# EAGLE design osdelux_proto_proc (EAGLE 8.5.1)
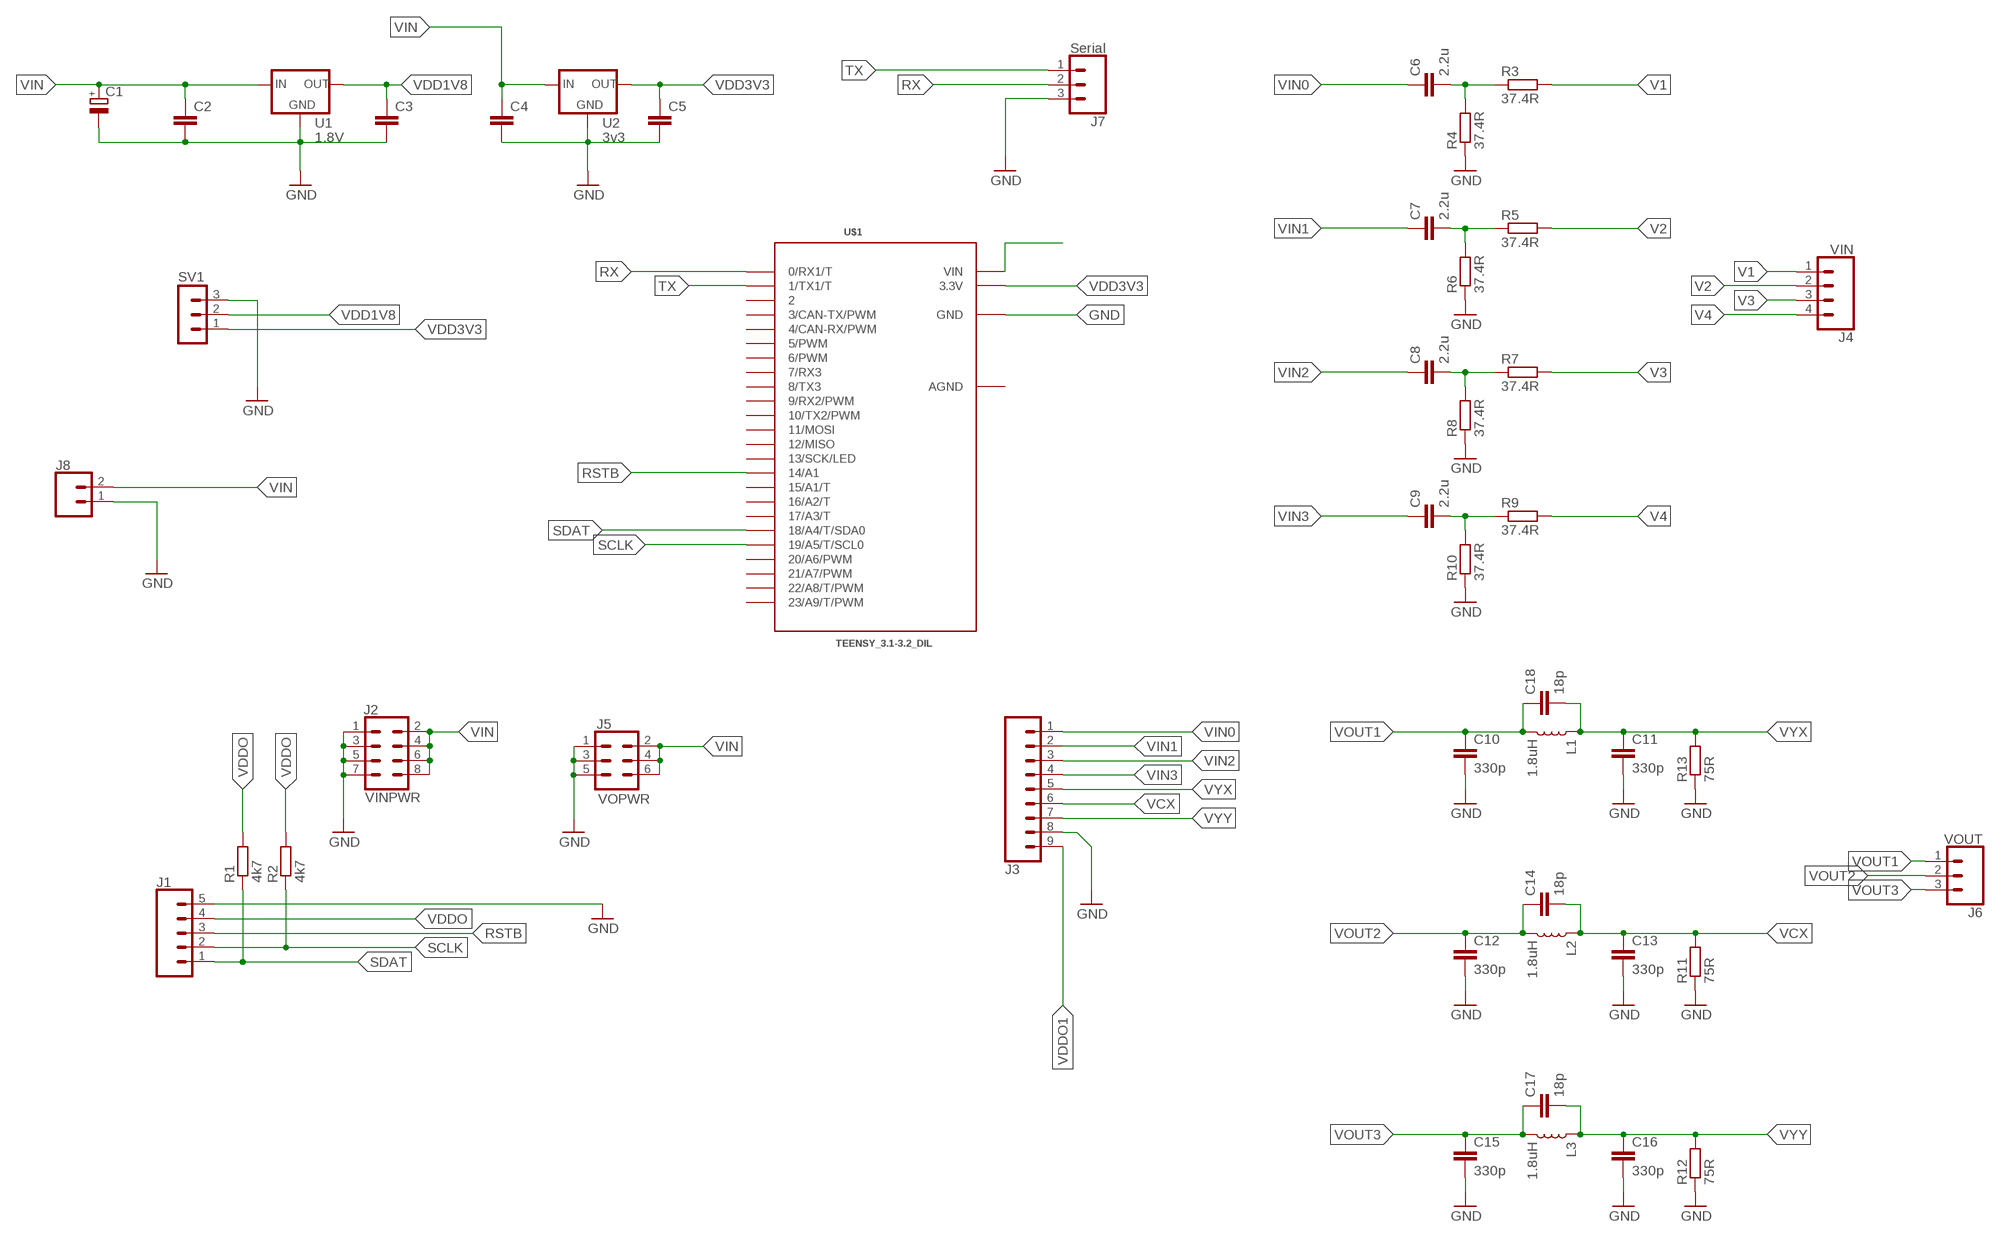
[diagram p0: schematic, sheet 1]

## Parts
C1  CPOL-EUE3.5-8  [E3,5-8]
C2  C-EUC1206K  [C1206K]
C3  C-EUC1206K  [C1206K]
C4  C-EUC1206K  [C1206K]
C5  C-EUC1206K  [C1206K]
C6  2.2u  C-EUC1206  [C1206]
C7  2.2u  C-EUC1206  [C1206]
C8  2.2u  C-EUC1206  [C1206]
C9  2.2u  C-EUC1206  [C1206]
C10  330p  C-EUC0805  [C0805]
C11  330p  C-EUC0805  [C0805]
C12  330p  C-EUC0805  [C0805]
C13  330p  C-EUC0805  [C0805]
C14  18p  C-EUC0805  [C0805]
C15  330p  C-EUC0805  [C0805]
C16  330p  C-EUC0805  [C0805]
C17  18p  C-EUC0805  [C0805]
C18  18p  C-EUC0805  [C0805]
J1  CONN_05LOCK_LONGPADS  [1X05_LOCK_LONGPADS]
J2  VINPWR  CONN_04X2  [2X4]
J3  CONN_09LOCK-LONGPADS  [1X09_LOCK_LONGPADS]
J4  VIN  CONN_04  [1X04]
J5  VOPWR  CONN_03X2FEMALE  [2X3]
J6  VOUT  CONN_03  [1X03]
J7  Serial  CONN_03  [1X03]
J8  CONN_02LOCK_LONGPADS  [1X02_LOCK_LONGPADS]
L1  1.8uH  INDUCTOR-0805-3.3UH  [0805]
L2  1.8uH  INDUCTOR-0805-3.3UH  [0805]
L3  1.8uH  INDUCTOR-0805-3.3UH  [0805]
R1  4k7  R-EU_R0805  [R0805]
R2  4k7  R-EU_R0805  [R0805]
R3  37.4R  R-EU_R0805  [R0805]
R4  37.4R  R-EU_R0805  [R0805]
R5  37.4R  R-EU_R0805  [R0805]
R6  37.4R  R-EU_R0805  [R0805]
R7  37.4R  R-EU_R0805  [R0805]
R8  37.4R  R-EU_R0805  [R0805]
R9  37.4R  R-EU_R0805  [R0805]
R10  37.4R  R-EU_R0805  [R0805]
R11  75R  R-EU_R0805  [R0805]
R12  75R  R-EU_R0805  [R0805]
R13  75R  R-EU_R0805  [R0805]
SV1  MA03-1  [MA03-1]
U1  1.8V  R-78E5.0-1.0  [DC-DC_CONVERTER_78XX]
U2  3v3  R-78E5.0-1.0  [DC-DC_CONVERTER_78XX]
U$1  TEENSY_3.1-3.2_DIL  [TEENSY_3.0-3.2&LC_DIL]

## Nets
DCIN: U$1.VIN
GND: C1.- C2.2 C3.2 C4.2 C5.2 C10.2 C11.2 C12.2 C13.2 C15.2 C16.2 J1.5 J2.1 J2.3 J2.5 J2.7 J3.8 J5.1 J5.3 J5.5 J7.3 J8.1 R4.1 R6.1 R8.1 R10.1 R11.1 R12.1 R13.1 SV1.3 U1.GND U2.GND U$1.GND
N$1: C6.2 R3.1 R4.2
N$3: C7.2 R5.1 R6.2
N$4: C8.2 R7.1 R8.2
N$5: C9.2 R9.1 R10.2
RSTB: J1.3 U$1.14/A0(14/A1)
RX: J7.2 U$1.0(0/RX1/T)
SCLK: J1.2 R2.1 U$1.19/A5(19/A5/T/SCL0)
SDAT: J1.1 R1.1 U$1.18/A4(18/A4/T/SDA0)
TX: J7.1 U$1.1(1/TX1/T)
V1: J4.1 R3.2
V2: J4.2 R5.2
V3: J4.3 R7.2
V4: J4.4 R9.2
VCX: C13.1 C14.2 J3.6 L2.1 R11.2
VDD1V8: C3.1 SV1.2 U1.VOUT(OUT)
VDD3V3: C5.1 SV1.1 U2.VOUT(OUT) U$1.3.3V
VDDO: J1.4 R1.2 R2.2
VDDO1: J3.9
VIN: C1.+ C2.1 C4.1 J2.2 J2.4 J2.6 J2.8 J5.2 J5.4 J5.6 J8.2 U1.VIN(IN) U2.VIN(IN)
VIN0: C6.1 J3.1
VIN1: C7.1 J3.2
VIN2: C8.1 J3.3
VIN3: C9.1 J3.4
VOUT1: C10.1 C18.1 J6.1 L1.2
VOUT2: C12.1 C14.1 J6.2 L2.2
VOUT3: C15.1 C17.1 J6.3 L3.2
VYX: C11.1 C18.2 J3.5 L1.1 R13.2
VYY: C16.1 C17.2 J3.7 L3.1 R12.2
Unconnected: U$1.2 U$1.3(3/CAN-TX/PWM) U$1.4(4/CAN-RX/PWM) U$1.5(5/PWM) U$1.6(6/PWM) U$1.7(7/RX3) U$1.8(8/TX3) U$1.9(9/RX2/PWM) U$1.10(10/TX2/PWM) U$1.11(11/MOSI) U$1.12(12/MISO) U$1.13(13/SCK/LED) U$1.15/A1(15/A1/T) U$1.16/A2(16/A2/T) U$1.17/A3(17/A3/T) U$1.20/A6(20/A6/PWM) U$1.21/A7(21/A7/PWM) U$1.22/A8(22/A8/T/PWM) U$1.23/A9(23/A9/T/PWM)

## Power pins joined to a net without a drawn wire
AGND: U$1.AGND

## Library data of the parts
C1 = rcl:CPOL-EU: POLARIZED CAPACITOR, European symbol; SPICEPREFIX: C
C2-C18 = rcl:C-EU: CAPACITOR, European symbol; SPICEPREFIX: C
J1 = SparkFun-Connectors:CONN_05: Multi connection point. Often used as Generic Header-pin footprint for 0.1 inch spaced/style header connections On any of the 0.1 inch spaced packages, you can populate with these: Break Away Headers - Straight <https://www.sparkfun.com/products/116> (PRT-00116) Break Away Male Headers - Right Angle <https://www.sparkfun.com/products/553> (PRT-00553) Female Headers <https://www.sparkfun.com/products/115> (PRT-00115) Break Away Headers - Machine Pin <https://www.sparkfun.com/products/117> (PRT-00117) Break Away Female Headers - Swiss Machine Pin <https://www.sparkfun.com/products/743> (PRT-00743) For SCREWTERMINALS and SPRING TERMINALS visit here: Screw Terimnals on SparkFun.com <https://www.sparkfun.com/search/results?term=Screw+Terminals> (5mm/3.5mm/2.54mm spacing) This device is also useful as a general connection point to wire up your design to another part of your project. Our various solder wires solder well into these plated through hole pads. Hook-Up Wire - Assortment (Stranded, 22 AWG) <https://www.sparkfun.com/products/11375> (PRT-11375) Hook-Up Wire - Assortment (Solid Core, 22 AWG) <https://www.sparkfun.com/products/11367> (PRT-11367) View the entire wire category on our website here <https://www.sparkfun.com/categories/141> Special notes: Molex polarized connector foot print use with SKU : PRT-08231 with associated crimp pins and housings. 1MM SMD Version SKU: PRT-10208
J2 = SparkFun-Connectors:CONN_04X2: Multi connection point. Often used as Generic Header-pin footprint for 0.1 inch spaced/style header connections On any of the 0.1 inch spaced packages, you can populate with these: Break Away Headers - Straight <https://www.sparkfun.com/products/116> (PRT-00116) Break Away Male Headers - Right Angle <https://www.sparkfun.com/products/553> (PRT-00553) Female Headers <https://www.sparkfun.com/products/115> (PRT-00115) Break Away Headers - Machine Pin <https://www.sparkfun.com/products/117> (PRT-00117) Break Away Female Headers - Swiss Machine Pin <https://www.sparkfun.com/products/743> (PRT-00743)
J3 = SparkFun-Connectors:CONN_09: Multi connection point. Often used as Generic Header-pin footprint for 0.1 inch spaced/style header connections On any of the 0.1 inch spaced packages, you can populate with these: Break Away Headers - Straight <https://www.sparkfun.com/products/116> (PRT-00116) Break Away Male Headers - Right Angle <https://www.sparkfun.com/products/553> (PRT-00553) Female Headers <https://www.sparkfun.com/products/115> (PRT-00115) Break Away Headers - Machine Pin <https://www.sparkfun.com/products/117> (PRT-00117) Break Away Female Headers - Swiss Machine Pin <https://www.sparkfun.com/products/743> (PRT-00743) For SCREWTERMINALS and SPRING TERMINALS visit here: Screw Terimnals on SparkFun.com <https://www.sparkfun.com/search/results?term=Screw+Terminals> (5mm/3.5mm/2.54mm spacing) This device is also useful as a general connection point to wire up your design to another part of your project. Our various solder wires solder well into these plated through hole pads. Hook-Up Wire - Assortment (Stranded, 22 AWG) <https://www.sparkfun.com/products/11375> (PRT-11375) Hook-Up Wire - Assortment (Solid Core, 22 AWG) <https://www.sparkfun.com/products/11367> (PRT-11367) View the entire wire category on our website here <https://www.sparkfun.com/categories/141> Special notes: Molex polarized connector foot print use with SKU : PRT-08231 with associated crimp pins and housings. 1MM SMD Version SKU: PRT-10208 NOTES ON THE VARIANTS LOCK and LOCK_LONGPADS... This footprint was designed to help hold the alignment of a through-hole component (i.e. 6-pin header) while soldering it into place. You may notice that each hole has been shifted either up or down by 0.005 of an inch from it's more standard position (which is a perfectly straight line). This slight alteration caused the pins (the squares in the middle) to touch the edges of the holes. Because they are alternating, it causes a "brace" to hold the component in place. 0.005 has proven to be the perfect amount of "off-center" position when using our standard breakaway headers. Although looks a little odd when you look at the bare footprint, once you have a header in there, the alteration is very hard to notice. Also,if you push a header all the way into place, it is covered up entirely on the bottom side.
J4 = SparkFun-Connectors:CONN_04: Multi connection point. Often used as Generic Header-pin footprint for 0.1 inch spaced/style header connections On any of the 0.1 inch spaced packages, you can populate with these: Break Away Headers - Straight <https://www.sparkfun.com/products/116> (PRT-00116) Break Away Male Headers - Right Angle <https://www.sparkfun.com/products/553> (PRT-00553) Female Headers <https://www.sparkfun.com/products/115> (PRT-00115) Break Away Headers - Machine Pin <https://www.sparkfun.com/products/117> (PRT-00117) Break Away Female Headers - Swiss Machine Pin <https://www.sparkfun.com/products/743> (PRT-00743) For SCREWTERMINALS and SPRING TERMINALS visit here: Screw Terimnals on SparkFun.com <https://www.sparkfun.com/search/results?term=Screw+Terminals> (5mm/3.5mm/2.54mm spacing) This device is also useful as a general connection point to wire up your design to another part of your project. Our various solder wires solder well into these plated through hole pads. Hook-Up Wire - Assortment (Stranded, 22 AWG) <https://www.sparkfun.com/products/11375> (PRT-11375) Hook-Up Wire - Assortment (Solid Core, 22 AWG) <https://www.sparkfun.com/products/11367> (PRT-11367) View the entire wire category on our website here <https://www.sparkfun.com/categories/141> Special notes: Molex polarized connector foot print use with SKU : PRT-08231 with associated crimp pins and housings. 1MM SMD Version SKU: PRT-10208; PROD_ID: CONN-09696
J5 = SparkFun-Connectors:CONN_03X2: Multi connection point. Often used as Generic Header-pin footprint for 0.1 inch spaced/style header connections You can populate with any combo of single row headers, but if you'd like an exact match, check these: Header - 2x3 (Male, 0.1") <https://www.sparkfun.com/products/12807> (PRT-12807) Header - 2x3 (Female, 0.1") <https://www.sparkfun.com/products/13010> (PRT-13010) 2x3 Pin Shrouded Header <https://www.sparkfun.com/products/10877> (PRT-10877) On any of the 0.1 inch spaced packages, you can populate with these: Break Away Headers - Straight <https://www.sparkfun.com/products/116> (PRT-00116) Break Away Male Headers - Right Angle <https://www.sparkfun.com/products/553> (PRT-00553) Female Headers <https://www.sparkfun.com/products/115> (PRT-00115) Break Away Headers - Machine Pin <https://www.sparkfun.com/products/117> (PRT-00117) Break Away Female Headers - Swiss Machine Pin <https://www.sparkfun.com/products/743> (PRT-00743) Special note: the shrouded connector mates well with our 3x2 ribbon cables: Ribbon Crimp Connector - 6-pin (2x3, Female) <https://www.sparkfun.com/products/10651> (PRT-10651) Ribbon Cable - 6 wire (15ft) <https://www.sparkfun.com/products/10646> (PRT-10646); PROD_ID: CONN-11566; VALUE: FEMALE 2x3
J6 J7 = SparkFun-Connectors:CONN_03: Multi connection point. Often used as Generic Header-pin footprint for 0.1 inch spaced/style header connections On any of the 0.1 inch spaced packages, you can populate with these: Break Away Headers - Straight <https://www.sparkfun.com/products/116> (PRT-00116) Break Away Male Headers - Right Angle <https://www.sparkfun.com/products/553> (PRT-00553) Female Headers <https://www.sparkfun.com/products/115> (PRT-00115) Break Away Headers - Machine Pin <https://www.sparkfun.com/products/117> (PRT-00117) Break Away Female Headers - Swiss Machine Pin <https://www.sparkfun.com/products/743> (PRT-00743) Stackable Header - 3 Pin (Female, 0.1") <https://www.sparkfun.com/products/13875> (PRT-13875) For SCREWTERMINALS and SPRING TERMINALS visit here: Screw Terimnals on SparkFun.com <https://www.sparkfun.com/search/results?term=Screw+Terminals> (5mm/3.5mm/2.54mm spacing) This device is also useful as a general connection point to wire up your design to another part of your project. Our various solder wires solder well into these plated through hole pads. Hook-Up Wire - Assortment (Stranded, 22 AWG) <https://www.sparkfun.com/products/11375> (PRT-11375) Hook-Up Wire - Assortment (Solid Core, 22 AWG) <https://www.sparkfun.com/products/11367> (PRT-11367) View the entire wire category on our website here <https://www.sparkfun.com/categories/141> Special notes: Molex polarized connector foot print use with SKU : PRT-08232 with associated crimp pins and housings.; PROD_ID: XXX-00000; VALUE: 455-1750-1-ND
J8 = SparkFun-Connectors:CONN_02: Multi connection point. Often used as Generic Header-pin footprint for 0.1 inch spaced/style header connections On any of the 0.1 inch spaced packages, you can populate with these: Break Away Headers - Straight <https://www.sparkfun.com/products/116> (PRT-00116) Break Away Male Headers - Right Angle <https://www.sparkfun.com/products/553> (PRT-00553) Female Headers <https://www.sparkfun.com/products/115> (PRT-00115) Break Away Headers - Machine Pin <https://www.sparkfun.com/products/117> (PRT-00117) Break Away Female Headers - Swiss Machine Pin <https://www.sparkfun.com/products/743> (PRT-00743) For SCREWTERMINALS and SPRING TERMINALS visit here: Screw Terimnals on SparkFun.com <https://www.sparkfun.com/search/results?term=Screw+Terminals> (5mm/3.5mm/2.54mm spacing) This device is also useful as a general connection point to wire up your design to another part of your project. Our various solder wires solder well into these plated through hole pads. Hook-Up Wire - Assortment (Stranded, 22 AWG) <https://www.sparkfun.com/products/11375> (PRT-11375) Hook-Up Wire - Assortment (Solid Core, 22 AWG) <https://www.sparkfun.com/products/11367> (PRT-11367) View the entire wire category on our website here <https://www.sparkfun.com/categories/141> Special notes: Molex polarized connector foot print use with: PRT-08233 with associated crimp pins and housings. 2.54_SCREWTERM for use with PRT-10571. 3.5mm Screw Terminal footprints for PRT-08084 5mm Screw Terminal footprints for use with PRT-08432
L1-L3 = SparkFun-Coils:INDUCTOR: Inductors Resist changes in electrical current. Basically a coil of wire. SparkFun Products: SparkFun Load Cell Amplifier - HX711 <https://www.sparkfun.com/products/13879> IOIO-OTG - V2.2 <https://www.sparkfun.com/products/13613>; PROD_ID: NDUC-13076; VALUE: 3.3µH/±20%/450mA
R1-R13 = rcl:R-EU_: RESISTOR, European symbol; SPICEPREFIX: R
SV1 = con-lstb:MA03-1: PIN HEADER; OC_FARNELL: unknown; OC_NEWARK: unknown
U1 U2 = SparkFun-IC-Power:R-78E5.0-1.0: Recom Power 5V 1A DC/DC Converter The Recom R-78E5.0-X.X is a compact DC/DC converter module that is a pin for pin drop-in replacement for the LM7805 linear voltage regulator. Specifications: Input Range: 7-28V Output Voltage: 5V Output Current: 1A Max Efficiency: 91% Datasheet <https://www.recom-power.com/pdf/Innoline/R-78Exx-1.0.pdf>; PROD_ID: COM-13655
U$1 = Teensy_3_and_LC_Series_Boards_v1.4:TEENSY_3.1-3.2_DIL: Teensy 3.1 or 3.2 in a DIL Layout.

## Board
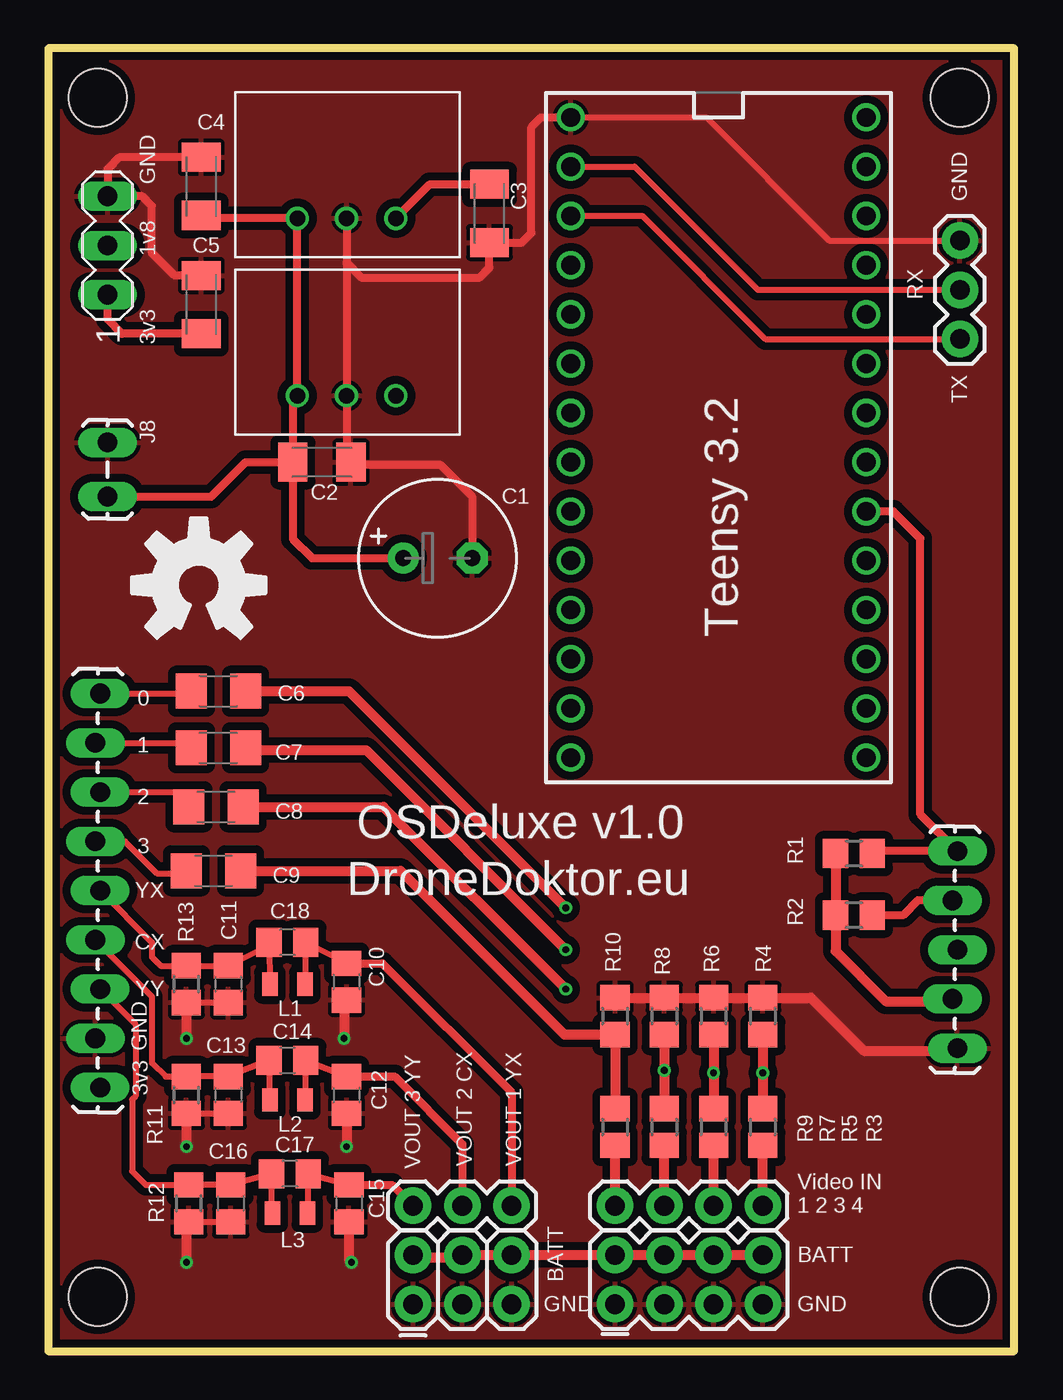
[diagram p1: board, top side]
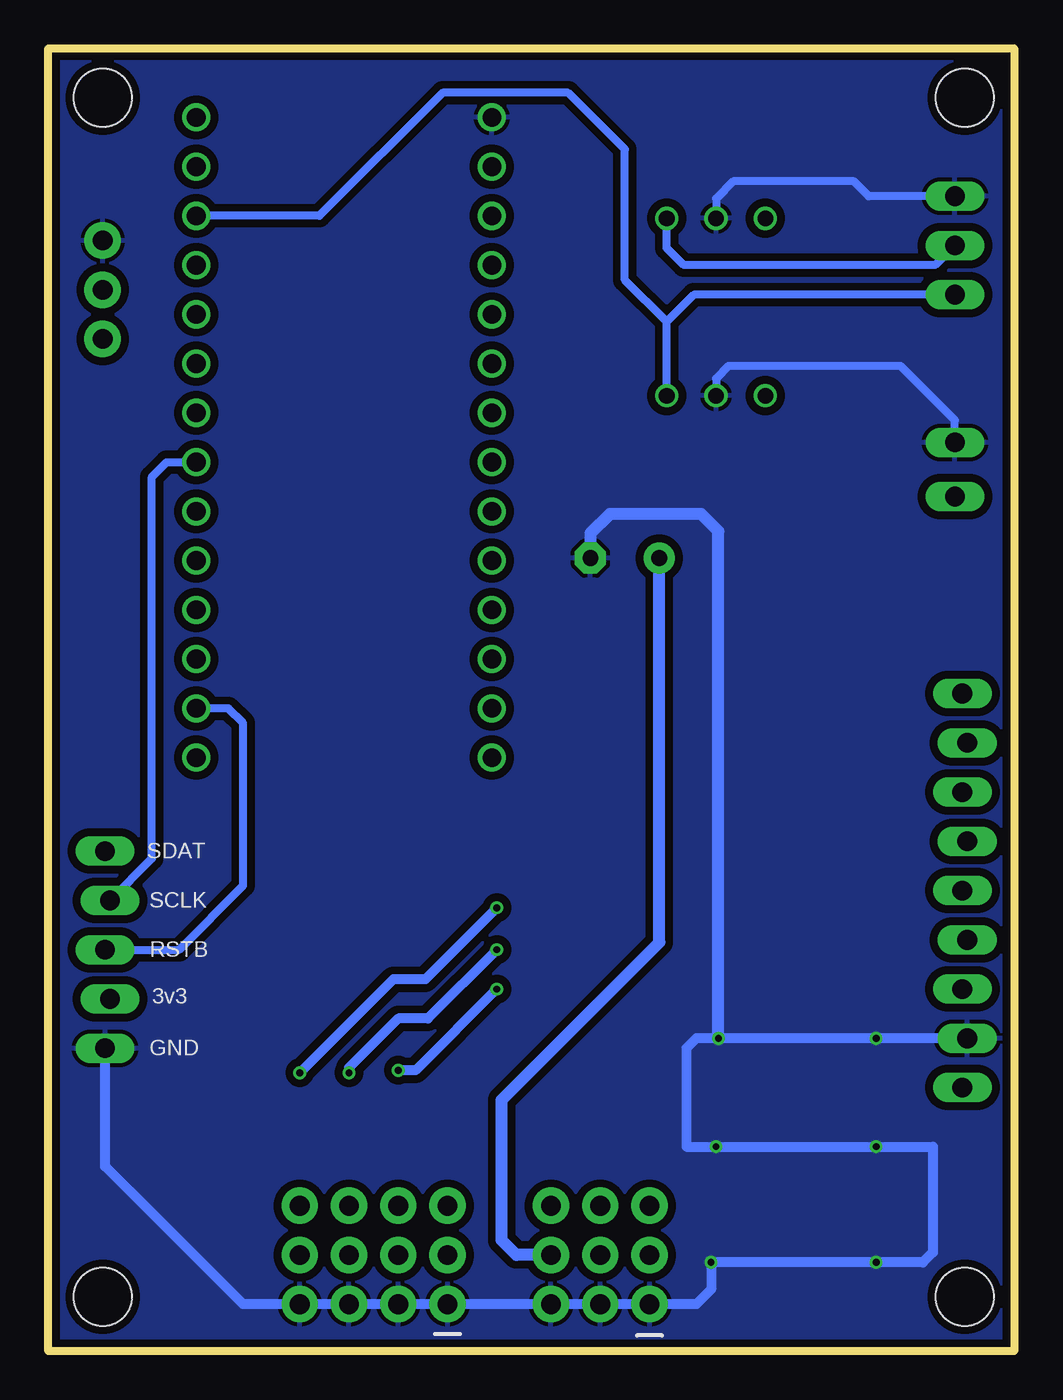
[diagram p2: board, bottom side, seen from below]

Size 49.78 x 67.18 mm. Coordinates in mm from the lower left corner, seen from the top.
Outline: 0,0 49.78,0 49.78,67.18 0,67.18 0,0
Copper layers (1*16): Top 0.018mm / dielectric 1.55mm / Bottom 0.018mm
Design rules "default *": minimum track width 6mil, minimum drill 0.3mm, track to track 6mil, track to pad 6mil, pad to pad 6mil, via to via 6mil, smd to smd 0mil, copper to edge 0.25mm, drill to drill 0.35mm, minimum pad ring 6mil, minimum via ring 6mil, stop-mask expansion 0mil, vias tented up to drill 0.45mm, thermal gap 0.2mm
Holes 3 mm at 46.99,2.79 46.99,64.64 2.54,64.64 2.54,2.79

### Footprints (pad centres in the part's own frame; a part is rotated, then mirrored left to right if it is on the bottom)
E3,5-8 = drill 0.813 pad 1.6: + -1.778,0 | drill 0.813 pad 1.6 octagon: - 1.778,0
C1206K = smd 1.5 x 2: 1 -1.5,0; 2 1.5,0
C1206 = smd 1.6 x 1.8: 1 -1.4,0; 2 1.4,0
C0805 = smd 1.3 x 1.5: 1 -0.95,0; 2 0.95,0
1X05_LOCK_LONGPADS = drill 1.016 long: 1 0,0; 2 2.54,-0.254; 3 5.08,0; 4 7.62,-0.254; 5 10.16,0
2X4 = drill 1.016 pad 1.88: 1 -3.81,-1.27; 2 -3.81,1.27; 3 -1.27,-1.27; 4 -1.27,1.27; 5 1.27,-1.27; 6 1.27,1.27; 7 3.81,-1.27; 8 3.81,1.27
1X09_LOCK_LONGPADS = drill 1.016 long: 1 0,0.127; 2 2.54,-0.127; 3 5.08,0.127; 4 7.62,-0.127; 5 10.16,0.127; 6 12.7,-0.127; 7 15.24,0.127; 8 17.78,-0.127; 9 20.32,0.127
1X04 = drill 1.016 pad 1.88: 1 0,0; 2 2.54,0; 3 5.08,0; 4 7.62,0
2X3 = drill 1.016 pad 1.88: 1 0,0; 2 0,2.54; 3 2.54,0; 4 2.54,2.54; 5 5.08,0; 6 5.08,2.54
1X03 = drill 1.016 pad 1.88: 1 0,0; 2 2.54,0; 3 5.08,0
1X02_LOCK_LONGPADS = drill 1.016 long: 1 -0.127,0; 2 2.667,0
0805 = smd 0.8 x 1.2: 1 -0.9,0; 2 0.9,0
R0805 = smd 1.3 x 1.5: 1 -0.95,0; 2 0.95,0
MA03-1 = drill 1.016 long: 1 -2.54,0; 2 0,0; 3 2.54,0
DC-DC_CONVERTER_78XX = drill 0.8: GND 0,0; VIN -2.54,0; VOUT 2.54,0
TEENSY_3.0-3.2&LC_DIL = drill 0.965: 0 -7.62,13.97; 1 -7.62,11.43; 2 -7.62,8.89; 3 -7.62,6.35; 3.3V 7.62,11.43; 4 -7.62,3.81; 5 -7.62,1.27; 6 -7.62,-1.27; 7 -7.62,-3.81; 8 -7.62,-6.35; 9 -7.62,-8.89; 10 -7.62,-11.43; 11 -7.62,-13.97; 12 -7.62,-16.51; 13 7.62,-16.51; 14/A0 7.62,-13.97; 15/A1 7.62,-11.43; 16/A2 7.62,-8.89; 17/A3 7.62,-6.35; 18/A4 7.62,-3.81; 19/A5 7.62,-1.27; 20/A6 7.62,1.27; 21/A7 7.62,3.81; 22/A8 7.62,6.35; 23/A9 7.62,8.89; AGND 7.62,13.97; GND -7.62,16.51; VIN 7.62,16.51

### Placement (x,y rotation side)
C1  20.07,40.89 0 top
C2  14.1,45.85 0 top
C3  22.73,58.67 270 top
C4  7.87,60.07 90 top
C5  7.87,53.97 90 top
C6  8.76,34.04 0 top
C7  8.76,31.11 0 top
C8  8.64,28.07 0 top
C9  8.51,24.77 0 top
C10  15.37,19.05 270 top
C11  9.27,18.92 270 top
C12  15.37,13.21 270 top
C13  9.27,13.21 270 top
C14  12.32,14.99 180 top
C15  15.49,7.62 270 top
C16  9.4,7.62 270 top
C17  12.45,9.14 180 top
C18  12.32,21.08 180 top
J1  46.86,25.78 270 top
J2  33.02,3.68 0 top
J3  2.54,33.91 270 top
J4  36.83,7.49 180 top
J5  18.8,2.41 0 top
J6  23.88,7.49 180 top
J7  46.99,52.2 90 top
J8  3.05,46.74 270 top
L1  12.32,18.92 0 top
L2  12.32,12.95 0 top
L3  12.45,7.11 0 top
R1  41.53,25.65 180 top
R2  41.53,22.48 180 top
R3  36.83,11.56 270 top
R4  36.83,17.27 270 top
R5  34.29,11.56 270 top
R6  34.29,17.27 270 top
R7  31.75,11.56 270 top
R8  31.75,17.27 270 top
R9  29.21,11.56 270 top
R10  29.21,17.27 270 top
R11  7.11,13.21 90 top
R12  7.24,7.62 90 top
R13  7.11,18.92 90 top
SV1  3.05,57.02 90 top
U1  15.37,58.42 0 top
U2  15.37,49.28 0 top
U$1  34.54,47.12 0 top
U$2  [OSHW-LOGO-L]  7.75,39.5 0 top

### Tracks (layer width: path | path; a pad name or v marks a point on that pad's centre or on a via)
GND  (via drill 0.35)
  Top 0.305: R12.1 C16.2 | R11.1 C13.2 | R13.1 C11.2 | U$1.GND 33.91,63.63 40.26,57.28 J7.3
  Top 0.406: C4.2 3.66,61.57 3.05,60.96 SV1.3 4.83,59.56 5.33,59.05 5.33,56.64 6.5,55.47 C5.2 | U$1.GND 25.4,63.63 24.89,63.12 24.89,57.66 24.41,57.17 C3.2 22.73,55.88 22.22,55.37 16.13,55.37 15.37,56.13 U1.GND U2.GND 15.37,46.08 C2.2 15.72,45.72 20.19,45.72 21.84,44.07 C1.-
  Top 0.508: R13.1 v7.11,16.13 | C10.2 15.24,17.97 v15.24,16.13 | R11.1 v7.11,10.54 | C12.2 v15.37,10.54 | R12.1 7.11,6.54 v7.11,4.57 | C15.2 15.49,4.7 v15.62,4.57 | R10.1 R8.1 R6.1 R4.1 39.31,18.22 42.04,15.49 46.74,15.49 J1.5
  Bottom 0.406: SV1.3 7.49,59.56 8.25,60.33 14.48,60.33 15.37,59.44 U1.GND | J8.1 3.05,48.01 5.84,50.8 14.73,50.8 15.37,50.17 U2.GND
  Bottom 0.508: J3.8 v7.11,16.13 v15.24,16.13 16.38,16.13 16.89,15.62 16.89,10.54 v15.37,10.54 v7.11,10.54 4.19,10.54 4.19,5.08 4.7,4.57 v7.11,4.57 v15.62,4.57 15.62,3.18 16.38,2.41 J5.1 J5.3 J5.5 J2.1 J2.3 J2.5 J2.7 39.75,2.41 46.86,9.53 J1.5
  Bottom 0.61: v15.24,16.13 15.24,42.29 16.13,43.18 20.83,43.18 21.84,42.16 C1.-
  pour Top (isolate 0.406): 0,67.18 49.78,67.18 49.78,-0.25 0,-0.25
  pour Bottom (isolate 0.406): -0.13,67.18 49.78,67.18 49.78,0 0.13,0
N$1  (via drill 0.35)
  Top 0.508: R4.2 v36.83,14.35 R3.1 | C6.2 15.49,34.04 v26.67,22.86
  Bottom 0.508: v26.67,22.86 30.35,19.18 32,19.18 v36.83,14.35
N$3  (via drill 0.35)
  Top 0.508: R6.2 v34.29,14.35 R5.1 | C7.2 10.29,30.99 16.38,30.99 v26.67,20.7
  Bottom 0.508: v26.67,20.7 30.23,17.14 31.75,17.14 34.29,14.61 v34.29,14.35
N$4  (via drill 0.35)
  Top 0.508: R8.2 v31.75,14.48 R7.1 | v26.67,18.67 17.27,28.07 C8.2
  Bottom 0.508: v26.67,18.67 30.86,14.48 v31.75,14.48
N$5
  Top 0.508: R9.1 R10.2 26.6,16.32 18.16,24.77 C9.2
RSTB
  Bottom 0.406: J1.3 43.05,20.7 39.75,24 39.75,32.39 40.51,33.15 U$1.14/A0
RX
  Top 0.305: U$1.0 30.23,61.09 36.58,54.74 J7.2
SCLK
  Top 0.406: J1.2 44.83,23.24 44.07,22.48 R2.1
  Bottom 0.406: J1.2 44.45,25.4 44.45,45.08 43.69,45.85 U$1.19/A5
SDAT
  Top 0.406: R1.1 42.61,25.78 J1.1 44.96,27.69 44.96,41.91 43.56,43.31 U$1.18/A4
TX
  Top 0.305: U$1.1 30.61,58.55 36.96,52.2 J7.1
V1
  Top 0.508: J4.1 R3.2
V2
  Top 0.508: J4.2 R5.2
V3
  Top 0.508: J4.3 R7.2
V4
  Top 0.508: J4.4 R9.2
VCX
  Top 0.305: L2.1 C14.2 C13.1 R11.2 6.03,14.16 5.33,14.86 5.33,18.29 J3.6
VDD1V8
  Top 0.406: U1.VOUT 19.66,60.17 C3.1
  Bottom 0.406: SV1.2 4.06,56.01 17.02,56.01 17.91,56.9 U1.VOUT
VDD3V3
  Top 0.406: C5.1 3.79,52.47 3.05,53.21 SV1.1
  Bottom 0.406: SV1.1 16.51,54.48 17.91,53.09 | U2.VOUT 17.91,53.09 | 17.91,53.09 20.07,55.25 20.07,61.98 22.99,64.9 29.46,64.9 35.81,58.55 U$1.3.3V
VDDO
  Top 0.508: R1.2 R2.2 40.58,20.64 43.18,18.03 46.48,18.03 J1.4
VIN
  Top 0.406: C4.1 8.02,58.42 U1.VIN U2.VIN 12.6,49.05 C2.1 | J8.2 8.38,44.07 10.16,45.85 C2.1 | C2.1 12.6,41.89 13.59,40.89 C1.+
  Top 0.508: J5.2 18.92,4.83 21.46,4.83 | 21.97,4.83 21.46,4.83 | 21.46,4.83 J5.4 J5.6 J2.2 J2.4 J2.6 J2.8
  Bottom 0.61: J5.6 25.65,4.95 26.42,5.71 26.42,12.95 18.29,21.08 C1.+
VIN0
  Top 0.305: J3.1 7.49,33.91 | 8,33.91 7.49,33.91 | 7.49,33.91 C6.1
VIN1
  Top 0.305: J3.2 7.11,31.37 C7.1
VIN2
  Top 0.305: J3.3 6.47,28.83 C8.1
VIN3
  Top 0.305: J3.4 3.94,26.29 5.59,24.64 6.98,24.64 C9.1
VOUT1
  Top 0.305: L1.2 C18.1 C10.1
  Top 0.406: C10.1 17.21,20 23.88,13.34 J6.1
VOUT2
  Top 0.305: L2.2 C14.1 C12.1
  Top 0.406: C12.1 17.85,14.16 21.34,10.67 J6.2
VOUT3
  Top 0.305: L3.2 13.4,7.11 C17.1 C15.1
  Top 0.406: C15.1 17.72,8.57 J6.3
VYX
  Top 0.305: C18.2 11.37,20.95 | 11.37,20.95 L1.1 | 11.37,20.95 C11.1 R13.2 5.78,19.87 5.33,20.32 5.33,21.08 J3.5
VYY
  Top 0.254: L3.1 11.5,7.11
  Top 0.305: L3.1 11.5,7.11 C17.2 C16.1 R12.2 5.02,8.57 4.32,9.27 4.32,12.97 4.5,13.15 4.5,16.84 J3.7

### Text on the board
tNames: GND | GND | 1v8 | RX | 3v3 | TX | Teensy 3.2 | 0 | 1 | 2 | OSDeluxe v1.0 | 3 | YX | DroneDoktor.eu | CX | YY | 3v3 | GND | VOUT 3 YY | VOUT 2 CX | VOUT 1 YX | Video IN / 1 2 3 4 | BATT | BATT | GND | GND
bNames: SDAT | SCLK | RSTB | 3v3 | GND